# EAGLE design TRI-LIMIT-INTERFACE (EAGLE 6.5.0)
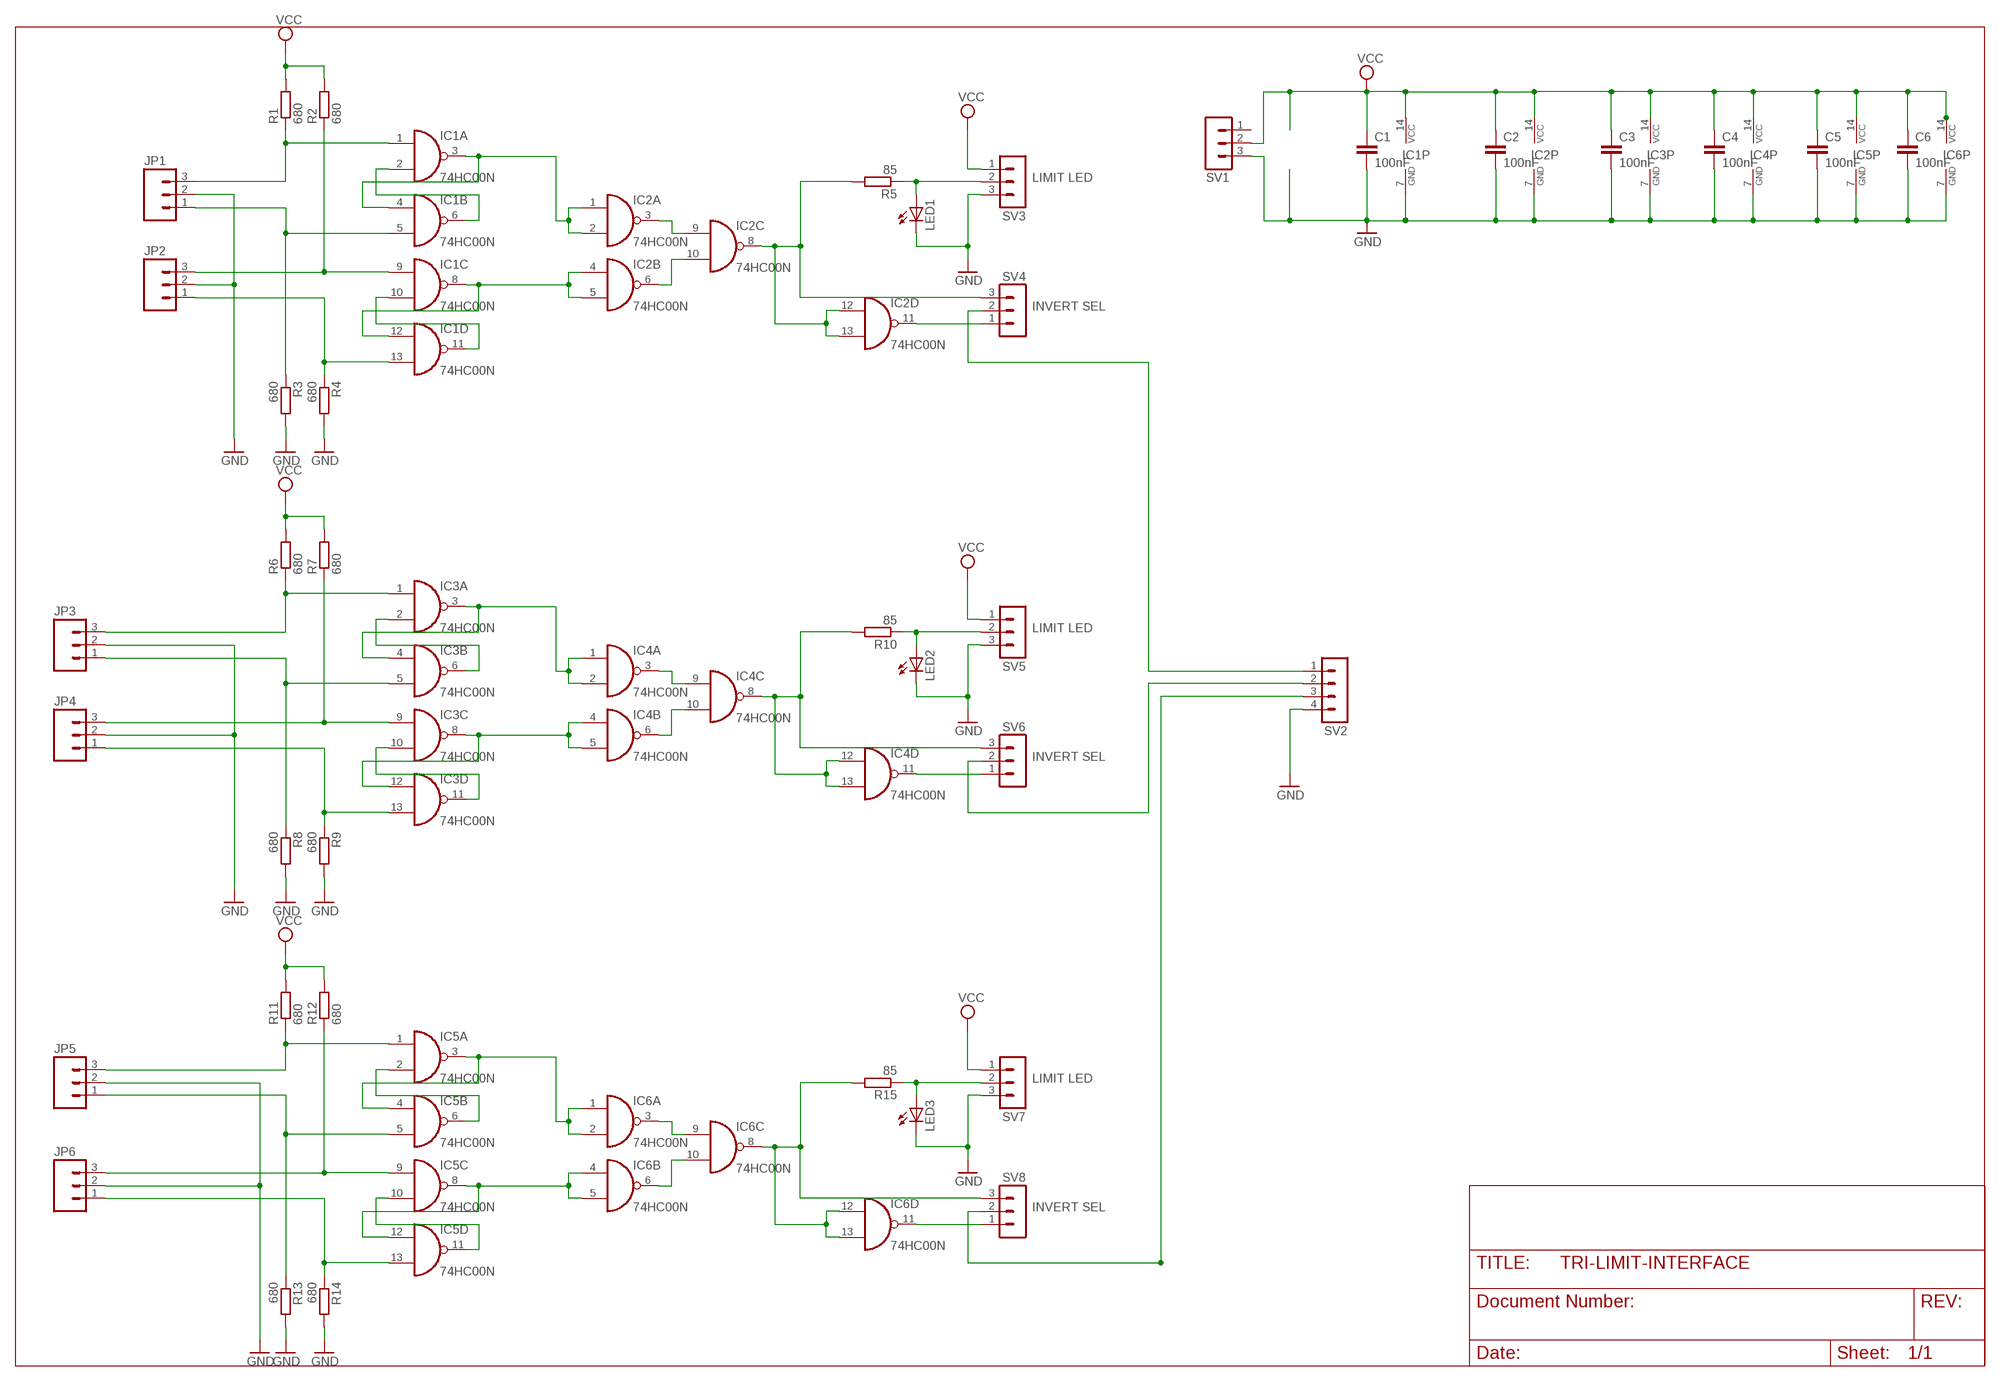
[diagram p0: schematic, sheet 1]

## Parts
C1  100nF  CAPPTH  [CAP-PTH-SMALL]
C2  100nF  CAPPTH  [CAP-PTH-SMALL]
C3  100nF  CAPPTH  [CAP-PTH-SMALL]
C4  100nF  CAPPTH  [CAP-PTH-SMALL]
C5  100nF  CAPPTH  [CAP-PTH-SMALL]
C6  100nF  CAPPTH  [CAP-PTH-SMALL]
IC1  74HC00N  [DIL14]
IC2  74HC00N  [DIL14]
IC3  74HC00N  [DIL14]
IC4  74HC00N  [DIL14]
IC5  74HC00N  [DIL14]
IC6  74HC00N  [DIL14]
JP1  M03-SCREW-5MM  [SCREWTERMINAL-5MM-3]
JP2  M03-SCREW-5MM  [SCREWTERMINAL-5MM-3]
JP3  M03-SCREW-5MM  [SCREWTERMINAL-5MM-3]
JP4  M03-SCREW-5MM  [SCREWTERMINAL-5MM-3]
JP5  M03-SCREW-5MM  [SCREWTERMINAL-5MM-3]
JP6  M03-SCREW-5MM  [SCREWTERMINAL-5MM-3]
LED1  LED3MM  [LED3MM]
LED2  LED3MM  [LED3MM]
LED3  LED3MM  [LED3MM]
R1  680  R-EU_0207/7  [0207/7]
R2  680  R-EU_0207/7  [0207/7]
R3  680  R-EU_0207/7  [0207/7]
R4  680  R-EU_0207/7  [0207/7]
R5  85  R-EU_0207/10  [0207/10]
R6  680  R-EU_0207/7  [0207/7]
R7  680  R-EU_0207/7  [0207/7]
R8  680  R-EU_0207/7  [0207/7]
R9  680  R-EU_0207/7  [0207/7]
R10  85  R-EU_0207/10  [0207/10]
R11  680  R-EU_0207/7  [0207/7]
R12  680  R-EU_0207/7  [0207/7]
R13  680  R-EU_0207/7  [0207/7]
R14  680  R-EU_0207/7  [0207/7]
R15  85  R-EU_0207/10  [0207/10]
SV1  MA03-1  [MA03-1]
SV2  MA04-1  [MA04-1]
SV3  MA03-1  [MA03-1]
SV4  MA03-1  [MA03-1]
SV5  MA03-1  [MA03-1]
SV6  MA03-1  [MA03-1]
SV7  MA03-1  [MA03-1]
SV8  MA03-1  [MA03-1]

## Nets
/SIG: IC2.11(D:O) SV4.1
/SIG1: IC4.11(D:O) SV6.1
/SIG2: IC6.11(D:O) SV8.1
GND: C1.2 C2.2 C3.2 C4.2 C5.2 C6.2 IC1.7(P:GND) IC2.7(P:GND) IC3.7(P:GND) IC4.7(P:GND) IC5.7(P:GND) IC6.7(P:GND) JP1.2 JP2.2 JP3.2 JP4.2 JP5.2 JP6.2 LED1.K(C) LED2.K(C) LED3.K(C) R3.2 R4.2 R8.2 R9.2 R13.2 R14.2 SV1.3 SV2.4 SV3.3 SV5.3 SV7.3
N$1: IC1.3(A:O) IC1.4(B:I0) IC2.1(A:I0) IC2.2(A:I1)
N$2: IC1.2(A:I1) IC1.6(B:O)
N$3: IC1.13(D:I1) JP2.1 R4.1
N$4: IC1.5(B:I1) JP1.1 R3.1
N$5: IC1.8(C:O) IC1.12(D:I0) IC2.4(B:I0) IC2.5(B:I1)
N$6: IC1.10(C:I1) IC1.11(D:O)
N$7: IC1.9(C:I0) JP2.3 R2.1
N$8: IC1.1(A:I0) JP1.3 R1.1
N$9: IC2.3(A:O) IC2.9(C:I0)
N$10: IC2.6(B:O) IC2.10(C:I1)
N$11: IC3.3(A:O) IC3.4(B:I0) IC4.1(A:I0) IC4.2(A:I1)
N$12: IC3.2(A:I1) IC3.6(B:O)
N$13: IC3.1(A:I0) JP3.3 R6.1
N$14: IC3.5(B:I1) JP3.1 R8.1
N$15: IC3.8(C:O) IC3.12(D:I0) IC4.4(B:I0) IC4.5(B:I1)
N$16: LED1.A R5.1 SV3.2
N$17: IC3.10(C:I1) IC3.11(D:O)
N$18: IC3.9(C:I0) JP4.3 R7.1
N$19: IC3.13(D:I1) JP4.1 R9.1
N$20: IC4.3(A:O) IC4.9(C:I0)
N$21: IC4.6(B:O) IC4.10(C:I1)
N$22: LED2.A R10.1 SV5.2
N$23: IC5.3(A:O) IC5.4(B:I0) IC6.1(A:I0) IC6.2(A:I1)
N$24: IC5.2(A:I1) IC5.6(B:O)
N$25: IC5.1(A:I0) JP5.3 R11.1
N$26: IC5.5(B:I1) JP5.1 R13.1
N$27: IC5.8(C:O) IC5.12(D:I0) IC6.4(B:I0) IC6.5(B:I1)
N$28: IC5.10(C:I1) IC5.11(D:O)
N$29: IC5.9(C:I0) JP6.3 R12.1
N$30: IC5.13(D:I1) JP6.1 R14.1
N$31: IC6.3(A:O) IC6.9(C:I0)
N$32: IC6.6(B:O) IC6.10(C:I1)
N$33: LED3.A R15.1 SV7.2
SIG: IC2.8(C:O) IC2.12(D:I0) IC2.13(D:I1) R5.2 SV4.3
SIG1: IC4.8(C:O) IC4.12(D:I0) IC4.13(D:I1) R10.2 SV6.3
SIG2: IC6.8(C:O) IC6.12(D:I0) IC6.13(D:I1) R15.2 SV8.3
TO_CPU0: SV2.1 SV4.2
TO_CPU1: SV2.2 SV6.2
TO_CPU2: SV2.3 SV8.2
VCC: C1.1 C2.1 C3.1 C4.1 C5.1 C6.1 IC1.14(P:VCC) IC2.14(P:VCC) IC3.14(P:VCC) IC4.14(P:VCC) IC5.14(P:VCC) IC6.14(P:VCC) R1.2 R2.2 R6.2 R7.2 R11.2 R12.2 SV1.2 SV3.1 SV5.1 SV7.1
Unconnected: SV1.1

## Notes on the sheet
- LIMIT LED
- INVERT SEL
- LIMIT LED
- INVERT SEL
- LIMIT LED
- INVERT SEL

## Library data of the parts
C1-C6 = SparkFun-Capacitors:CAP: Capacitor Standard 0603 ceramic capacitor, and 0.1" leaded capacitor.
IC1-IC6 = 74xx-eu:74*00: Quad 2-input NAND gate
JP1-JP6 = SparkFun-Connectors:M03: Header 3 Standard 3-pin 0.1" header. Use with straight break away headers (SKU : PRT-00116), right angle break away headers (PRT-00553), swiss pins (PRT-00743), machine pins (PRT-00117), and female headers (PRT-00115). Molex polarized connector foot print use with SKU : PRT-08232 with associated crimp pins and housings.; STOREFRONT_ID: PRT-08433
LED1-LED3 = led:LED: LED OSRAM: - CHIPLED LG R971, LG N971, LY N971, LG Q971, LY Q971, LO R971, LY R971 LH N974, LH R974 LS Q976, LO Q976, LY Q976 LO Q996 - Hyper CHIPLED LW Q18S LB Q993, LB Q99A, LB R99A - SideLED LS A670, LO A670, LY A670, LG A670, LP A670 LB A673, LV A673, LT A673, LW A673 LH A674 LY A675 LS A676, LA A676, LO A676, LY A676, LW A676 LS A679, LY A679, LG A679 - Hyper Micro SIDELED® LS Y876, LA Y876, LO Y876, LY Y876 LT Y87S - SmartLED LW L88C, LW L88S LB L89C, LB L89S, LG L890 LS L89K, LO L89K, LY L89K LS L896, LA L896, LO L896, LY L896 - TOPLED LS T670, LO T670, LY T670, LG T670, LP T670 LSG T670, LSP T670, LSY T670, LOP T670, LYG T670 LG T671, LOG T671, LSG T671 LB T673, LV T673, LT T673, LW T673 LH T674 LS T676, LA T676, LO T676, LY T676, LB T676, LH T676, LSB T676, LW T676 LB T67C, LV T67C, LT T67C, LS T67K, LO T67K, LY T67K, LW E67C LS E67B, LA E67B, LO E67B, LY E67B, LB E67C, LV E67C, LT E67C LW T67C LS T679, LY T679, LG T679 LS T770, LO T770, LY T770, LG T770, LP T770 LB T773, LV T773, LT T773, LW T773 LH T774 LS E675, LA E675, LY E675, LS T675 LS T776, LA T776, LO T776, LY T776, LB T776 LHGB T686 LT T68C, LB T68C - Hyper Mini TOPLED® LB M676 - Mini TOPLED Santana® LG M470 LS M47K, LO M47K, LY M47K Source: http://www.osram.convergy.de LUXEON: - LUMILED® LXK2-PW12-R00, LXK2-PW12-S00, LXK2-PW14-U00, LXK2-PW14-V00 LXK2-PM12-R00, LXK2-PM12-S00, LXK2-PM14-U00 LXK2-PE12-Q00, LXK2-PE12-R00, LXK2-PE12-S00, LXK2-PE14-T00, LXK2-PE14-U00 LXK2-PB12-K00, LXK2-PB12-L00, LXK2-PB12-M00, LXK2-PB14-N00, LXK2-PB14-P00, LXK2-PB14-Q00 LXK2-PR12-L00, LXK2-PR12-M00, LXK2-PR14-Q00, LXK2-PR14-R00 LXK2-PD12-Q00, LXK2-PD12-R00, LXK2-PD12-S00 LXK2-PH12-R00, LXK2-PH12-S00 LXK2-PL12-P00, LXK2-PL12-Q00, LXK2-PL12-R00 Source: www.luxeon.com KINGBRIGHT: KA-3528ASYC Source: www.kingbright.com
R1-R15 = resistor:R-EU_: RESISTOR, European symbol
SV1 SV3-SV8 = con-lstb:MA03-1: PIN HEADER; OC_FARNELL: unknown; OC_NEWARK: unknown
SV2 = con-lstb:MA04-1: PIN HEADER; OC_FARNELL: unknown; OC_NEWARK: unknown

## Board
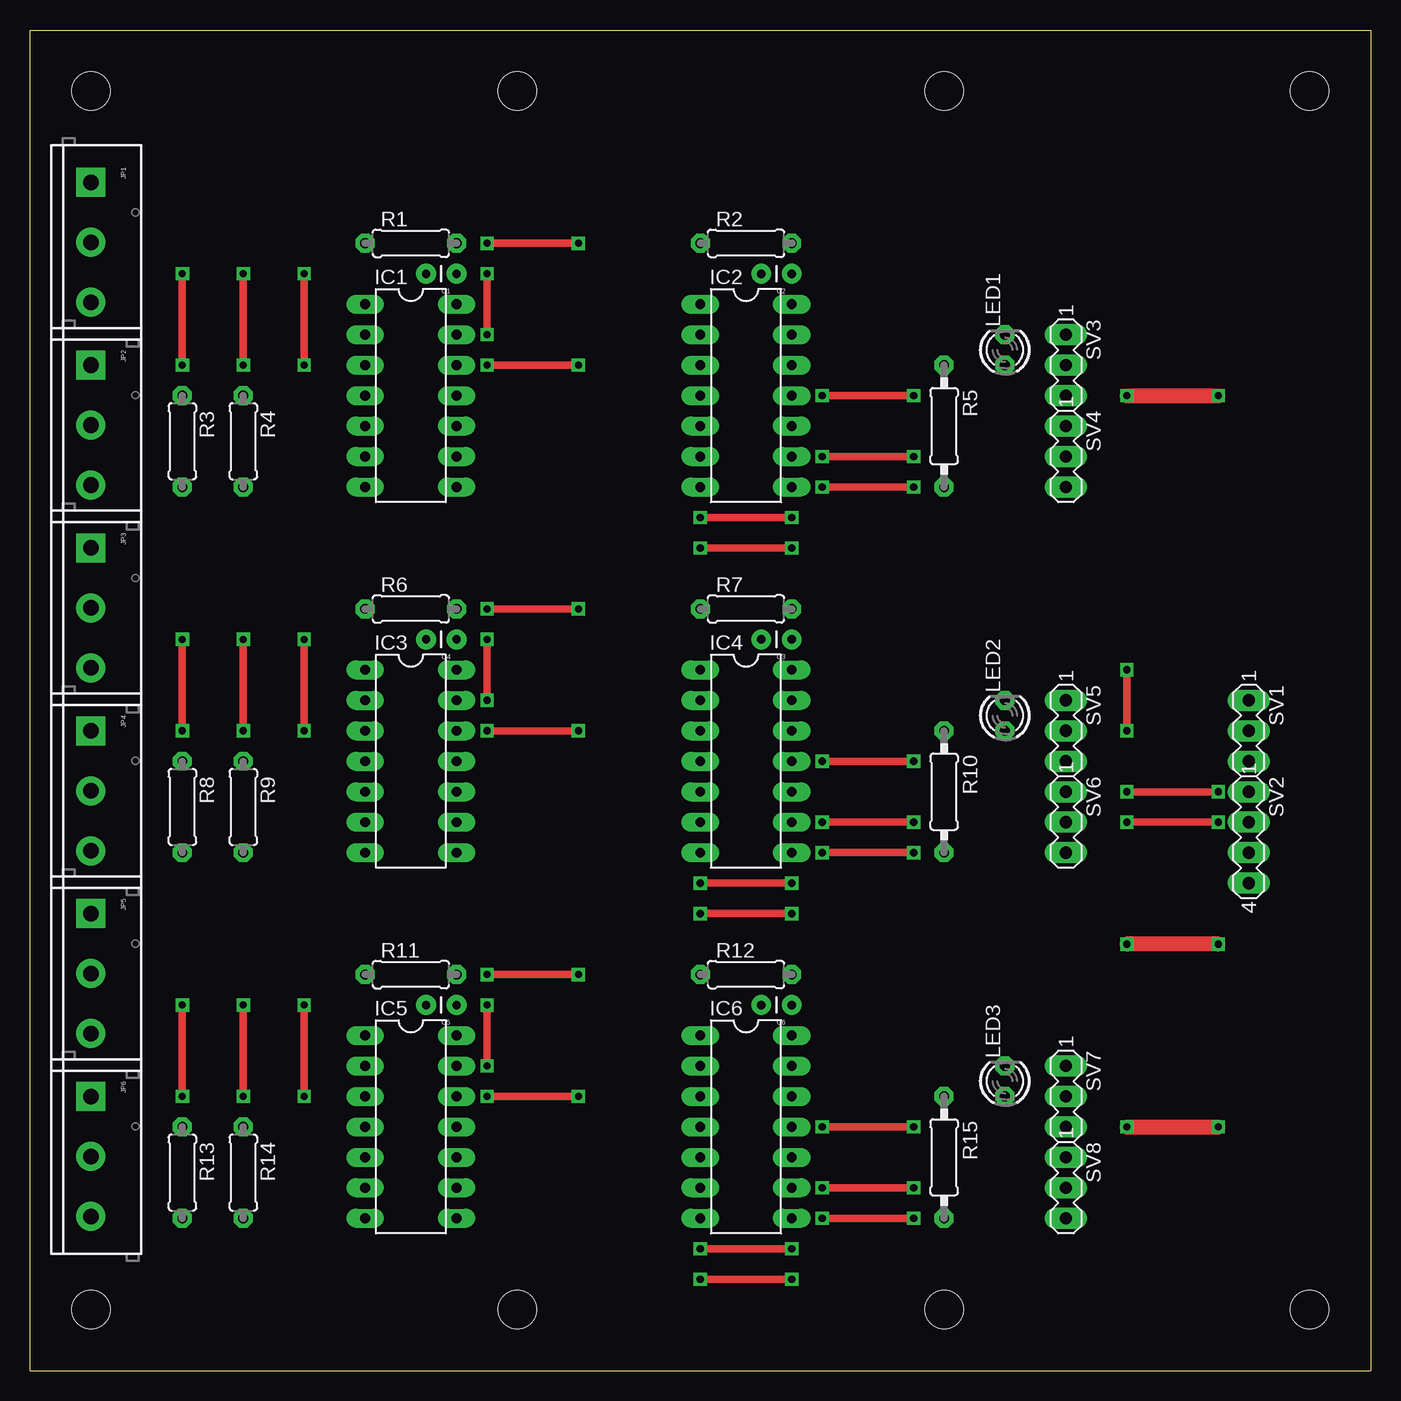
[diagram p1: board, top side]
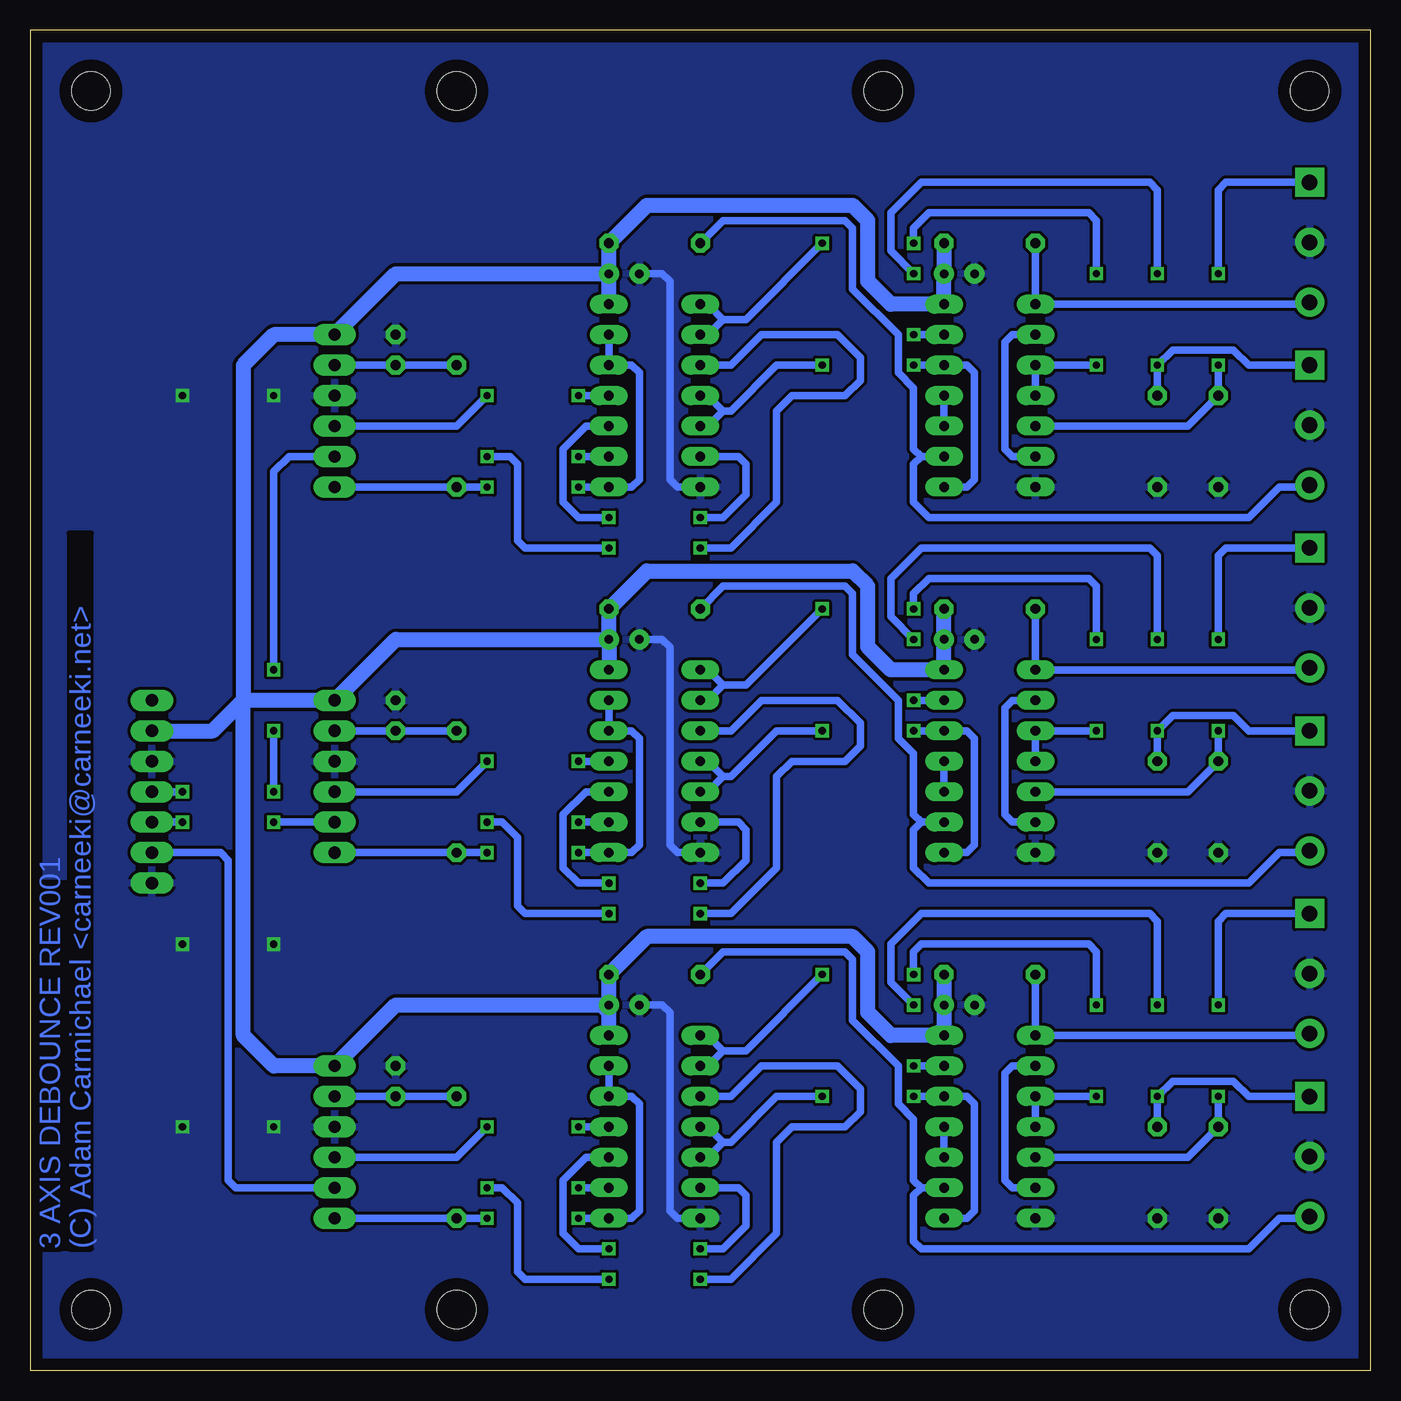
[diagram p2: board, bottom side, seen from below]

Size 111.76 x 111.76 mm. Coordinates in mm from the lower left corner, seen from the top.
Outline: 111.74,0 0,0 0,111.76 111.76,111.76 111.76,0
Copper layers (1*16): Top 0.035mm / dielectric 1.5mm / Bottom 0.035mm
Design rules "routedPCB *": minimum track width 20mil, minimum drill 20mil, track to track 10mil, track to pad 10mil, pad to pad 10mil, via to via 10mil, smd to smd 10mil, copper to edge 40mil, drill to drill 10mil, minimum pad ring 15mil, minimum via ring 10mil, stop-mask expansion 0mil, vias tented up to drill 0mil, thermal gap 10mil
Holes 3.2 mm at 5.08,106.68 5.08,5.08 106.68,5.08 106.68,106.68 76.2,106.68 76.2,5.08 40.64,106.68 40.64,5.08

### Footprints (pad centres in the part's own frame; a part is rotated, then mirrored left to right if it is on the bottom)
CAP-PTH-SMALL = drill 0.7 pad 1.651: 1 0,0; 2 2.54,0
DIL14 = drill 0.813 long: 1 -7.62,-3.81; 2 -5.08,-3.81; 3 -2.54,-3.81; 4 0,-3.81; 5 2.54,-3.81; 6 5.08,-3.81; 7 7.62,-3.81; 8 7.62,3.81; 9 5.08,3.81; 10 2.54,3.81; 11 0,3.81; 12 -2.54,3.81; 13 -5.08,3.81; 14 -7.62,3.81
SCREWTERMINAL-5MM-3 = drill 1.3 pad 2.413 square: 1 0,0 | drill 1.3 pad 2.413: 2 5,0; 3 10,0
LED3MM = drill 0.813 octagon: A -1.27,0; K 1.27,0
0207/7 = drill 0.813 octagon: 1 -3.81,0; 2 3.81,0
0207/10 = drill 0.813 octagon: 1 -5.08,0; 2 5.08,0
MA03-1 = drill 1.016 long: 1 -2.54,0; 2 0,0; 3 2.54,0
MA04-1 = drill 1.016 long: 1 -3.81,0; 2 -1.27,0; 3 1.27,0; 4 3.81,0

### Placement (x,y rotation side)
C1  35.56,91.44 180 top
C2  63.5,91.44 180 top
C3  63.5,60.96 180 top
C4  35.56,60.96 180 top
C5  35.56,30.48 180 top
C6  63.5,30.48 180 top
IC1  31.75,81.28 270 top
IC2  59.69,81.28 270 top
IC3  31.75,50.8 270 top
IC4  59.69,50.8 270 top
IC5  31.75,20.32 270 top
IC6  59.69,20.32 270 top
JP1  5.08,99.06 270 top
JP2  5.08,83.82 270 top
JP3  5.08,68.58 270 top
JP4  5.08,53.34 270 top
JP5  5.08,38.1 270 top
JP6  5.08,22.86 270 top
LED1  81.28,85.09 90 top
LED2  81.28,54.61 90 top
LED3  81.28,24.13 90 top
R1  31.75,93.98 0 top
R2  59.69,93.98 0 top
R3  12.7,77.47 270 top
R4  17.78,77.47 270 top
R5  76.2,78.74 270 top
R6  31.75,63.5 0 top
R7  59.69,63.5 0 top
R8  12.7,46.99 270 top
R9  17.78,46.99 270 top
R10  76.2,48.26 270 top
R11  31.75,33.02 0 top
R12  59.69,33.02 0 top
R13  12.7,16.51 270 top
R14  17.78,16.51 270 top
R15  76.2,17.78 270 top
SV1  101.6,53.34 270 top
SV2  101.6,44.45 270 top
SV3  86.36,83.82 270 top
SV4  86.36,76.2 270 top
SV5  86.36,53.34 270 top
SV6  86.36,45.72 270 top
SV7  86.36,22.86 270 top
SV8  86.36,15.24 270 top

### Tracks (layer width: path | path; a pad name or v marks a point on that pad's centre or on a via)
/SIG  (via drill 0.6)
  Top 0.61: v66.04,81.28 v73.66,81.28
  Bottom 0.61: SV4.1 76.2,78.74 v73.66,81.28 | IC2.11 v66.04,81.28
/SIG1  (via drill 0.6)
  Top 0.61: v66.04,50.8 v73.66,50.8
  Bottom 0.61: v73.66,50.8 76.2,48.26 SV6.1 | IC4.11 v66.04,50.8
/SIG2  (via drill 0.6)
  Top 0.61: v66.04,20.32 v73.66,20.32
  Bottom 0.61: IC6.11 v66.04,20.32 | v73.66,20.32 76.2,17.78 SV8.1
GND  (via drill 0.6)
  Top 1.27: v99.06,35.56 v91.44,35.56 | v91.44,81.28 v99.06,81.28 | v91.44,20.32 v99.06,20.32
  Bottom 0.61: IC6.7 57.78,12.7 58.42,13.34 58.42,29.84 59.05,30.48 C6.2 | IC2.7 57.78,73.66 58.42,74.3 58.42,90.81 59.05,91.44 C2.2 | IC4.7 57.78,43.18 58.42,43.81 58.42,60.33 59.05,60.96 C3.2
  pour Bottom: 0,0 111.76,0 111.76,111.76 0,111.76
N$1  (via drill 0.6)
  Top 0.61: v22.86,83.82 v22.86,91.44 | v45.72,93.98 v38.1,93.98
  Bottom 0.61: IC1.4 IC1.3 v22.86,83.82 | v22.86,91.44 22.86,95.89 23.5,96.52 36.83,96.52 38.1,95.25 v38.1,93.98 | v45.72,93.98 52.07,87.63 53.98,87.63 | 53.98,87.63 55.24,88.9 IC2.1 | IC2.2 55.24,86.36 53.98,87.63
N$2
  Bottom 0.61: IC1.6 29.84,76.2 30.48,76.83 30.48,85.72 29.84,86.36 IC1.2
N$3  (via drill 0.6)
  Top 0.61: v17.78,91.44 v17.78,83.82 | v38.1,86.36 v38.1,91.44
  Bottom 0.61: IC1.13 36.83,86.36 | IC1.13 34.29,86.36 | R4.1 v17.78,83.82 16.51,85.09 11.43,85.09 10.16,83.82 JP2.1 | IC1.13 v38.1,86.36 | v38.1,91.44 40.01,93.34 40.01,96.52 37.47,99.06 18.41,99.06 17.78,98.42 v17.78,91.44
N$4  (via drill 0.6)
  Top 0.61: v12.7,91.44 v12.7,83.82
  Bottom 0.61: IC1.5 15.24,78.74 R3.1 v12.7,83.82 | JP1.1 12.06,99.06 12.7,98.42 v12.7,91.44
N$5  (via drill 0.6)
  Top 0.61: v38.1,83.82 v45.72,83.82
  Bottom 0.61: IC1.8 33.66,73.66 33.02,74.3 33.02,83.19 33.66,83.82 IC1.12 v38.1,83.82 | v45.72,83.82 49.53,83.82 53.34,80.01 53.98,80.01 | IC2.4 55.24,81.28 53.98,80.01 | 53.98,80.01 55.24,78.74 IC2.5
N$6
  Bottom 0.61: IC1.10 IC1.11
N$7
  Bottom 0.61: IC1.9 37.47,76.2 | JP2.3 5.24,73.66 7.62,73.66 10.16,71.12 36.83,71.12 38.1,72.39 38.1,75.56 37.47,76.2 | 37.47,76.2 38.1,76.83 38.1,81.92 39.37,83.19 39.37,86.36 43.18,90.17 43.18,95.25 43.81,95.89 53.98,95.89 R2.1
N$8
  Bottom 0.61: R1.1 IC1.1 5.24,88.9 JP1.3
N$9  (via drill 0.6)
  Top 0.61: v66.04,76.2 v73.66,76.2 | v55.88,68.58 v63.5,68.58
  Bottom 0.61: IC2.9 v66.04,76.2 | v55.88,68.58 53.34,68.58 49.53,72.39 49.53,80.01 48.26,81.28 43.81,81.28 42.55,82.55 42.55,84.45 44.45,86.36 50.8,86.36 53.34,83.82 IC2.3 | v63.5,68.58 70.48,68.58 71.12,69.22 71.12,75.56 71.75,76.2 v73.66,76.2
N$10  (via drill 0.6)
  Top 0.61: v55.88,71.12 v63.5,71.12
  Bottom 0.61: v55.88,71.12 53.98,71.12 52.07,73.03 52.07,75.56 52.7,76.2 IC2.6 | IC2.10 65.41,78.74 67.31,76.83 67.31,72.39 66.04,71.12 v63.5,71.12
N$11  (via drill 0.6)
  Top 0.61: v38.1,63.5 v45.72,63.5 | v22.86,60.96 v22.86,53.34
  Bottom 0.61: IC3.4 IC3.3 v22.86,53.34 | v38.1,63.5 38.1,64.77 36.83,66.04 23.5,66.04 22.86,65.41 v22.86,60.96 | v45.72,63.5 52.07,57.15 53.98,57.15 | 53.98,57.15 55.24,58.42 IC4.1 | IC4.2 55.24,55.88 53.98,57.15
N$12
  Bottom 0.61: IC3.6 29.84,45.72 30.48,46.35 30.48,55.24 29.84,55.88 IC3.2
N$13
  Bottom 0.61: R6.1 IC3.1 5.24,58.42 JP3.3
N$14  (via drill 0.6)
  Top 0.61: v12.7,60.96 v12.7,53.34
  Bottom 0.61: JP3.1 12.06,68.58 12.7,67.94 v12.7,60.96 | v12.7,53.34 R8.1 15.24,48.26 IC3.5
N$15  (via drill 0.6)
  Top 0.61: v38.1,53.34 v45.72,53.34
  Bottom 0.61: IC3.8 33.66,43.18 33.02,43.81 33.02,52.7 33.66,53.34 IC3.12 v38.1,53.34 | v45.72,53.34 49.53,53.34 53.34,49.53 53.98,49.53 | 53.98,49.53 55.24,50.8 IC4.4 | IC4.5 55.24,48.26 53.98,49.53
N$16
  Bottom 0.61: SV3.2 LED1.A R5.1
N$17
  Bottom 0.61: IC3.10 IC3.11
N$18
  Bottom 0.61: JP4.3 5.08,43.18 7.62,43.18 10.16,40.64 36.83,40.64 38.1,41.91 38.1,45.09 37.47,45.72 | 37.47,45.72 IC3.9 | 37.47,45.72 38.1,46.35 38.1,51.44 39.37,52.7 39.37,55.88 43.18,59.69 43.18,64.77 43.81,65.41 53.98,65.41 R7.1
N$19  (via drill 0.6)
  Top 0.61: v17.78,60.96 v17.78,53.34 | v38.1,60.96 v38.1,55.88
  Bottom 0.61: JP4.1 10.16,53.34 11.43,54.61 16.51,54.61 v17.78,53.34 R9.1 | v17.78,60.96 17.78,67.94 18.41,68.58 37.47,68.58 40.01,66.04 40.01,62.87 v38.1,60.96 | v38.1,55.88 IC3.13
N$20  (via drill 0.6)
  Top 0.61: v55.88,38.1 v63.5,38.1 | v73.66,45.72 v66.04,45.72
  Bottom 0.61: IC4.3 53.34,53.34 50.8,55.88 44.45,55.88 42.55,53.98 42.55,52.07 43.81,50.8 48.26,50.8 49.53,49.53 49.53,41.91 53.34,38.1 v55.88,38.1 | v63.5,38.1 70.48,38.1 71.12,38.73 71.12,44.45 72.39,45.72 v73.66,45.72 | v66.04,45.72 IC4.9
N$21  (via drill 0.6)
  Top 0.61: v55.88,40.64 v63.5,40.64
  Bottom 0.61: IC4.6 52.7,45.72 52.07,45.09 52.07,42.55 53.98,40.64 v55.88,40.64 | v63.5,40.64 66.04,40.64 67.31,41.91 67.31,46.35 65.41,48.26 IC4.10
N$22
  Bottom 0.61: SV5.2 LED2.A R10.1
N$23  (via drill 0.6)
  Top 0.61: v22.86,22.86 v22.86,30.48 | v45.72,33.02 v38.1,33.02
  Bottom 0.61: IC5.4 IC5.3 v22.86,22.86 | v22.86,30.48 22.86,34.92 23.5,35.56 37.47,35.56 38.1,34.92 v38.1,33.02 | IC6.2 55.24,25.4 53.98,26.67 | IC6.1 55.24,27.94 53.98,26.67 | 53.98,26.67 52.07,26.67 v45.72,33.02
N$24
  Bottom 0.61: IC5.6 29.84,15.24 30.48,15.88 30.48,24.77 29.84,25.4 IC5.2
N$25
  Bottom 0.61: R11.1 IC5.1 5.24,27.94 JP5.3
N$26  (via drill 0.6)
  Top 0.61: v12.7,30.48 v12.7,22.86
  Bottom 0.61: JP5.1 12.06,38.1 12.7,37.47 v12.7,30.48 | v12.7,22.86 R13.1 15.24,17.78 IC5.5
N$27  (via drill 0.6)
  Top 0.61: v38.1,22.86 v45.72,22.86
  Bottom 0.61: IC5.8 33.66,12.7 33.02,13.34 33.02,22.23 33.66,22.86 IC5.12 v38.1,22.86 | IC6.5 55.24,17.78 53.98,19.05 | 53.98,19.05 55.24,20.32 IC6.4 | v45.72,22.86 49.53,22.86 53.34,19.05 53.98,19.05
N$28
  Bottom 0.61: IC5.10 IC5.11
N$29
  Bottom 0.61: JP6.3 5.08,12.7 7.62,12.7 10.16,10.16 37.47,10.16 38.1,10.79 38.1,14.61 37.47,15.24 | 37.47,15.24 IC5.9 | 37.47,15.24 38.1,15.88 38.1,20.95 39.37,22.23 39.37,25.4 43.18,29.21 43.18,34.29 43.81,34.92 53.98,34.92 R12.1
N$30  (via drill 0.6)
  Top 0.61: v17.78,22.86 v17.78,30.48 | v38.1,30.48 v38.1,25.4
  Bottom 0.61: JP6.1 10.16,22.86 11.43,24.13 16.51,24.13 v17.78,22.86 R14.1 | v17.78,30.48 17.78,37.47 18.41,38.1 37.47,38.1 40.01,35.56 40.01,32.38 v38.1,30.48 | v38.1,25.4 IC5.13
N$31  (via drill 0.6)
  Top 0.61: v66.04,15.24 v73.66,15.24 | v63.5,7.62 v55.88,7.62
  Bottom 0.61: IC6.3 53.34,22.86 50.8,25.4 44.45,25.4 42.55,23.5 42.55,21.59 43.81,20.32 48.26,20.32 49.53,19.05 49.53,11.43 53.34,7.62 v55.88,7.62 | IC6.9 v66.04,15.24 | v73.66,15.24 72.39,15.24 71.12,13.97 71.12,8.26 70.48,7.62 v63.5,7.62
N$32  (via drill 0.6)
  Top 0.61: v55.88,10.16 v63.5,10.16
  Bottom 0.61: IC6.6 52.7,15.24 52.07,14.61 52.07,12.06 53.98,10.16 v55.88,10.16 | v63.5,10.16 66.04,10.16 67.31,11.43 67.31,15.88 65.41,17.78 IC6.10
N$33
  Bottom 0.61: SV7.2 LED3.A R15.1
SIG  (via drill 0.6)
  Top 0.61: v66.04,73.66 v73.66,73.66
  Bottom 0.61: IC2.8 61.59,73.66 60.96,74.3 60.96,83.19 61.59,83.82 IC2.12 IC2.13 | IC2.8 62.87,73.66 | SV4.3 R5.2 v73.66,73.66 | IC2.8 v66.04,73.66
SIG1  (via drill 0.6)
  Top 0.61: v66.04,43.18 v73.66,43.18
  Bottom 0.61: v66.04,43.18 IC4.8 61.59,43.18 60.96,43.81 60.96,52.7 61.59,53.34 IC4.12 IC4.13 | v73.66,43.18 R10.2 SV6.3
SIG2  (via drill 0.6)
  Top 0.61: v66.04,12.7 v73.66,12.7
  Bottom 0.61: v66.04,12.7 IC6.8 61.59,12.7 60.96,13.34 60.96,22.23 61.59,22.86 IC6.12 IC6.13 | v73.66,12.7 R15.2 SV8.3
TO_CPU0  (via drill 0.6)
  Top 0.61: v91.44,48.26 v99.06,48.26 | v91.44,58.42 v91.44,53.34
  Bottom 0.61: 100.33,48.26 SV2.1 v99.06,48.26 | SV4.2 90.17,76.2 91.44,74.93 v91.44,58.42 | v91.44,53.34 v91.44,48.26
TO_CPU1  (via drill 0.6)
  Top 0.61: v91.44,45.72 v99.06,45.72
  Bottom 0.61: SV6.2 v91.44,45.72 | v99.06,45.72 SV2.2
TO_CPU2
  Bottom 0.61: SV8.2 94.61,15.24 95.25,15.88 95.25,42.55 95.89,43.18 SV2.3
VCC
  Bottom 1.27: IC2.14 C2.1 | C2.1 81.28,91.44 SV3.1 91.44,86.36 93.98,83.82 93.98,55.88 | C2.1 R2.2 60.33,97.16 43.18,97.16 41.91,95.89 41.91,90.81 40.01,88.9 IC1.14 C1.1 R1.2 | C3.1 81.28,60.96 SV5.1 93.98,55.88 | C3.1 R7.2 60.33,66.67 43.18,66.67 41.91,65.41 41.91,60.33 40.01,58.42 IC3.14 C4.1 R6.2 | C3.1 IC4.14 | 64.14,30.48 81.28,30.48 SV7.1 91.44,25.4 93.98,27.94 93.98,55.88 | 64.14,30.48 C6.1 R12.2 60.33,36.2 43.18,36.2 41.91,34.92 41.91,29.84 40.01,27.94 36.2,27.94 35.56,28.57 R11.2 C5.1 IC5.14 | IC6.14 63.5,29.84 64.14,30.48 | SV1.2 96.52,53.34 93.98,55.88

### Text on the board
Bottom: (C) Adam Carmichael <carneeki@carneeki.net> | 3 AXIS DEBOUNCE REV001